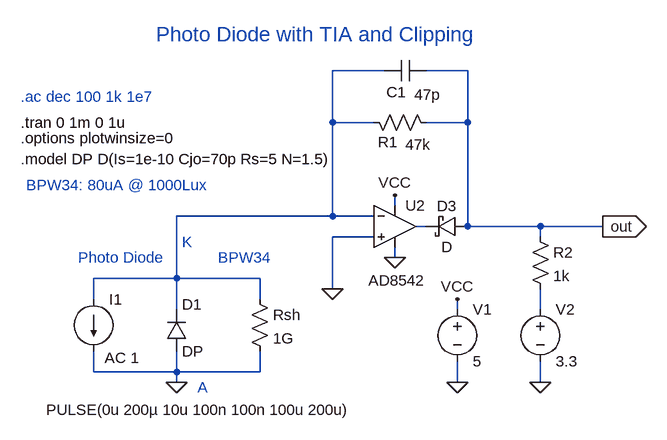
[diagram p0: schematic BPW34.asc]
BPW34.asc, the LTspice schematic file:
Version 4
SHEET 1 1224 804
WIRE 320 32 240 32
WIRE 448 32 384 32
WIRE 240 112 240 32
WIRE 304 112 240 112
WIRE 448 112 448 32
WIRE 448 112 384 112
WIRE 336 240 336 224
WIRE 240 256 240 112
WIRE 240 256 0 256
WIRE 304 256 240 256
WIRE 384 272 368 272
WIRE 448 272 448 112
WIRE 560 272 448 272
WIRE 656 272 560 272
WIRE 304 288 240 288
WIRE 560 288 560 272
WIRE 336 320 336 304
WIRE 0 352 0 256
WIRE 0 352 -128 352
WIRE 128 352 0 352
WIRE 240 368 240 288
WIRE -128 384 -128 352
WIRE 128 384 128 352
WIRE 0 400 0 352
WIRE 432 400 432 384
WIRE 560 400 560 368
WIRE -128 496 -128 464
WIRE 0 496 0 464
WIRE 0 496 -128 496
WIRE 128 496 128 464
WIRE 128 496 0 496
WIRE 0 512 0 496
WIRE 432 512 432 480
WIRE 560 512 560 480
FLAG 240 368 0
FLAG 336 224 VCC
FLAG 432 512 0
FLAG 432 384 VCC
FLAG 0 512 0
FLAG 656 272 out
IOPIN 656 272 Out
FLAG 336 320 0
FLAG 560 512 0
SYMBOL res 400 128 M270
WINDOW 0 -30 75 VTop 2
WINDOW 3 -2 28 VBottom 2
SYMATTR InstName R1
SYMATTR Value 47k
SYMBOL voltage 432 384 R0
WINDOW 123 24 132 Left 0
WINDOW 39 0 0 Left 0
SYMATTR InstName V1
SYMATTR Value 5
SYMBOL diode -16 464 M180
WINDOW 0 24 72 Left 2
WINDOW 3 24 0 Left 2
SYMATTR InstName D1
SYMATTR Value DP
SYMBOL current -128 384 R0
WINDOW 3 -73 170 Left 2
WINDOW 123 17 90 Left 2
WINDOW 39 0 0 Left 0
SYMATTR Value PULSE(0u 200µ 10u 100n 100n 100u 200u)
SYMATTR Value2 AC 1
SYMATTR InstName I1
SYMBOL res 112 368 R0
WINDOW 0 36 40 Left 2
WINDOW 3 36 76 Left 2
SYMATTR InstName Rsh
SYMATTR Value 1G
SYMBOL cap 384 16 R90
WINDOW 0 65 46 VBottom 2
WINDOW 3 37 -2 VTop 2
SYMATTR InstName C1
SYMATTR Value 47p
SYMBOL Opamps\\AD8542 336 208 R0
WINDOW 0 16 32 Left 2
WINDOW 3 -41 147 Left 2
SYMATTR InstName U2
SYMBOL voltage 560 384 R0
WINDOW 123 24 132 Left 0
WINDOW 39 0 0 Left 0
SYMATTR InstName V2
SYMATTR Value 3.3
SYMBOL res 544 272 R0
WINDOW 0 36 40 Left 2
WINDOW 3 36 76 Left 2
SYMATTR InstName R2
SYMATTR Value 1k
SYMBOL schottky 448 256 R90
WINDOW 0 0 32 VBottom 2
WINDOW 3 32 32 VTop 2
SYMATTR InstName D3
TEXT -240 112 Left 2 !.tran 0 1m 0 1u
TEXT -240 136 Left 2 !.options plotwinsize=0
TEXT -240 72 Left 2 ;.ac dec 100 1k 1e7
TEXT -240 168 Left 2 !.model DP D(Is=1e-10 Cjo=70p Rs=5 N=1.5)
TEXT -32 -24 Left 3 ;Photo Diode with TIA and Clipping
TEXT -152 320 Left 2 ;Photo Diode
TEXT 8 296 Left 2 ;K
TEXT 32 520 Left 2 ;A
TEXT 64 320 Left 2 ;BPW34
TEXT -232 208 Left 2 ;BPW34: 80uA @ 1000Lux

The netlist it stands for:
* BPW34.asc
R1 out N001 47k
V1 VCC 0 5
D1 0 N001 DP
I1 N001 0 PULSE(0u 200µ 10u 100n 100n 100u 200u) AC 1
Rsh N001 0 1G
C1 out N001 47p
XU2 0 N001 VCC 0 N002 AD8542  ; pins In+ In- V+ V- OUT
V2 N003 0 3.3
R2 out N003 1k
D3 out N002 D
.model D D
.lib standard.dio
.tran 0 1m 0 1u
.options plotwinsize=0
* .ac dec 100 1k 1e7
.model DP D(Is=1e-10 Cjo=70p Rs=5 N=1.5)
* Photo Diode with TIA and Clipping
* Photo Diode
* K
* A
* BPW34
* BPW34: 80uA @ 1000Lux
.lib AD8542.sub
.backanno
.end